# Altium schematic sheet DRV8306HRSMRDRV8306HRSMR.schdoc
size 127 x 101 mm
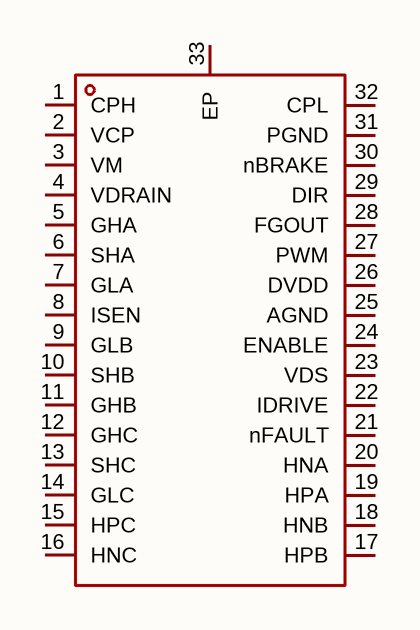
[diagram p0: DRV8306HRSMRDRV8306HRSMR.schdoc]

## Parts
U?  (no value)

## Nets

Not connected (* = marked no-connect by the designer): U? 1(CPH) 2(VCP) 3(VM) 4(VDRAIN) 5(GHA) 6(SHA) 7(GLA) 8(ISEN) 9(GLB) 10(SHB) 11(GHB) 12(GHC) 13(SHC) 14(GLC) 15(HPC) 16(HNC) 17(HPB) 18(HNB) 19(HPA) 20(HNA) 21(nFAULT) 22(IDRIVE) 23(VDS) 24(ENABLE) 25(AGND) 26(DVDD) 27(PWM) 28(FGOUT) 29(DIR) 30(nBRAKE) 31(PGND) 32(CPL) 33(EP)

## Library data of the parts
U? = DRV8306HRSMR: Symbol: DRV8306HRSMR